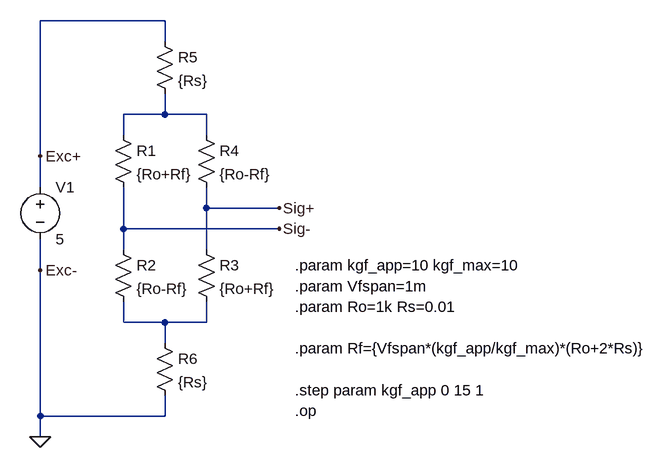
[diagram p0: schematic UnamplifiedLoadCellModel.asc]
UnamplifiedLoadCellModel.asc, the LTspice schematic file:
Version 4
SHEET 1 2064 704
WIRE 128 -112 -64 -112
WIRE 128 -80 128 -112
WIRE 128 32 128 0
WIRE 128 32 64 32
WIRE 192 32 128 32
WIRE 64 64 64 32
WIRE 192 64 192 32
WIRE -64 96 -64 -112
WIRE -64 144 -64 96
WIRE 192 176 192 144
WIRE 304 176 192 176
WIRE 64 208 64 144
WIRE 304 208 64 208
WIRE 64 240 64 208
WIRE 192 240 192 176
WIRE -64 272 -64 224
WIRE 64 352 64 320
WIRE 128 352 64 352
WIRE 192 352 192 320
WIRE 192 352 128 352
WIRE 128 384 128 352
WIRE -64 496 -64 272
WIRE 128 496 128 464
WIRE 128 496 -64 496
WIRE -64 528 -64 496
FLAG -64 528 0
FLAG -64 96 Exc+
FLAG -64 272 Exc-
FLAG 304 176 Sig+
FLAG 304 208 Sig-
SYMBOL res 48 48 R0
SYMATTR InstName R1
SYMATTR Value {Ro+Rf}
SYMBOL res 48 224 R0
SYMATTR InstName R2
SYMATTR Value {Ro-Rf}
SYMBOL res 176 224 R0
SYMATTR InstName R3
SYMATTR Value {Ro+Rf}
SYMBOL res 176 48 R0
SYMATTR InstName R4
SYMATTR Value {Ro-Rf}
SYMBOL res 112 -96 R0
SYMATTR InstName R5
SYMATTR Value {Rs}
SYMBOL res 112 368 R0
SYMATTR InstName R6
SYMATTR Value {Rs}
SYMBOL voltage -64 128 R0
SYMATTR InstName V1
SYMATTR Value 5
TEXT 328 328 Left 2 !.param Ro=1k Rs=0.01
TEXT 328 264 Left 2 !.param kgf_app=10 kgf_max=10
TEXT 328 296 Left 2 !.param Vfspan=1m
TEXT 328 392 Left 2 !.param Rf={Vfspan*(kgf_app/kgf_max)*(Ro+2*Rs)}
TEXT 328 456 Left 2 !.step param kgf_app 0 15 1
TEXT 328 488 Left 2 !.op

The netlist it stands for:
* UnamplifiedLoadCellModel.asc
R1 N001 Sig- {Ro+Rf}
R2 Sig- N002 {Ro-Rf}
R3 Sig+ N002 {Ro+Rf}
R4 N001 Sig+ {Ro-Rf}
R5 Exc+ N001 {Rs}
R6 N002 0 {Rs}
V1 Exc+ 0 5
.param Ro=1k Rs=0.01
.param kgf_app=10 kgf_max=10
.param Vfspan=1m
.param Rf={Vfspan*(kgf_app/kgf_max)*(Ro+2*Rs)}
.step param kgf_app 0 15 1
.op
.backanno
.end